# EAGLE schematic pressure_foot (EAGLE 6.2)
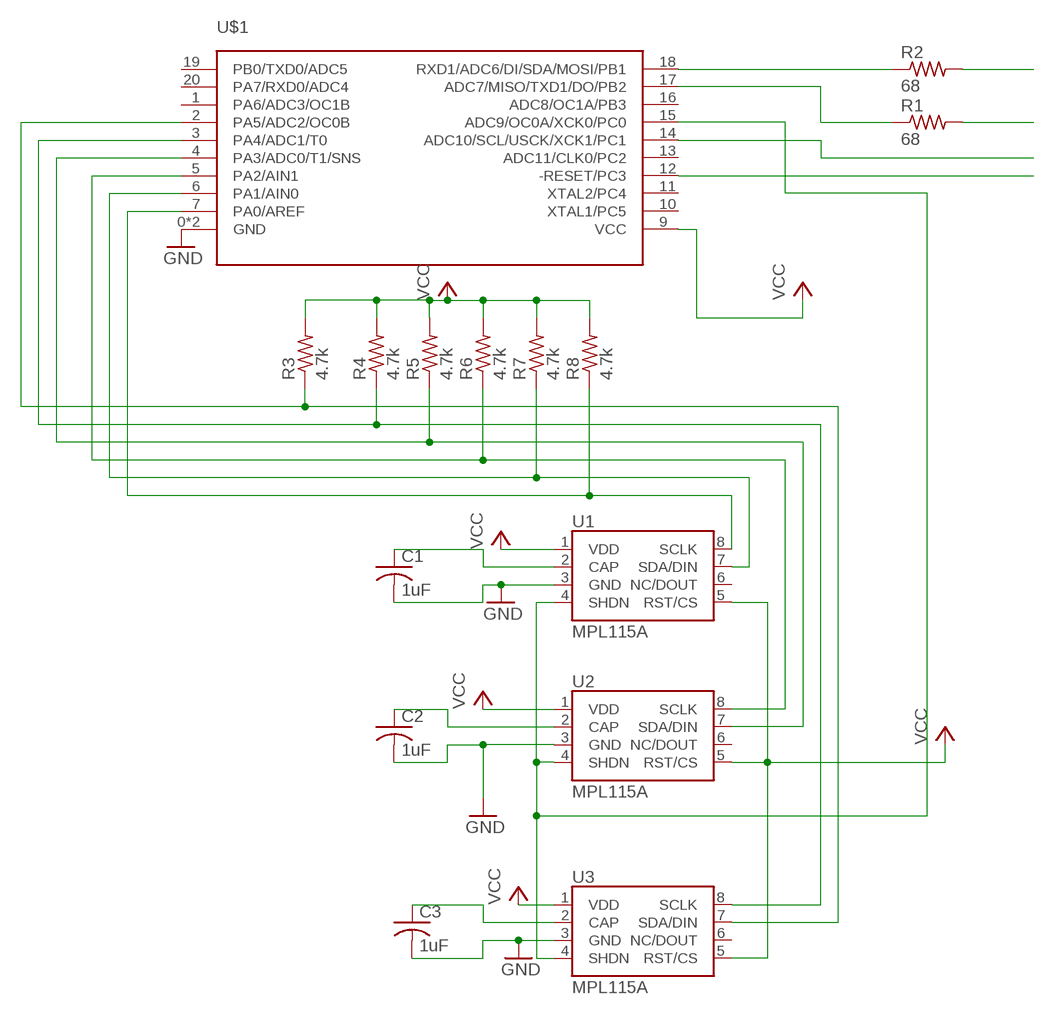
[diagram p0: schematic, sheet 1]

## Parts
C1  1uF  C-USC0603  [C0603]
C2  1uF  C-USC0603  [C0603]
C3  1uF  C-USC0603  [C0603]
R1  68  R-US_R0603  [R0603]
R2  68  R-US_R0603  [R0603]
R3  4.7k  R-US_R0603  [R0603]
R4  4.7k  R-US_R0603  [R0603]
R5  4.7k  R-US_R0603  [R0603]
R6  4.7k  R-US_R0603  [R0603]
R7  4.7k  R-US_R0603  [R0603]
R8  4.7k  R-US_R0603  [R0603]
U1  MPL115A  [LGA8]
U2  MPL115A  [LGA8]
U3  MPL115A  [LGA8]
U$1  ATTINY1634QFN20  [QFN20]

## Nets
GND: C1.2 C2.2 C3.2 U1.3(GND) U2.3(GND) U3.3(GND) U$1.0(GND) U$1.8(GND)
N$1: R8.1 U1.8(SCLK) U$1.7(PA0/AREF)
N$2: R1.2
N$3: R2.1 U$1.18(RXD1/ADC6/DI/SDA/MOSI/PB1)
N$4: R1.1 U$1.17(ADC7/MISO/TXD1/DO/PB2)
N$5: R2.2
N$6: C1.1 U1.2(CAP)
N$7: C3.1 U3.2(CAP)
N$8: R6.1 U2.8(SCLK) U$1.5(PA2/AIN1)
N$9: R5.1 U2.7(SDA/DIN) U$1.4(PA3/ADC0/T1/SNS)
N$10: U1.4(SHDN) U2.4(SHDN) U3.4(SHDN) U$1.15(ADC9/OC0A/XCK0/PC0)
N$11: C2.1 U2.2(CAP)
N$12: R7.1 U1.7(SDA/DIN) U$1.6(PA1/AIN0)
N$13: R4.1 U3.8(SCLK) U$1.3(PA4/ADC1/T0)
N$14: R3.1 U3.7(SDA/DIN) U$1.2(PA5/ADC2/OC0B)
N$15: U$1.14(ADC10/SCL/USCK/XCK1/PC1)
N$16: U$1.12(-RESET/PC3)
VCC: R3.2 R4.2 R5.2 R6.2 R7.2 R8.2 U1.1(VDD) U1.5(RST/CS) U2.1(VDD) U2.5(RST/CS) U3.1(VDD) U3.5(RST/CS) U$1.9(VCC)
Unconnected: U1.6(NC/DOUT) U2.6(NC/DOUT) U3.6(NC/DOUT) U$1.1(PA6/ADC3/OC1B) U$1.10(XTAL1/PC5) U$1.11(XTAL2/PC4) U$1.13(ADC11/CLK0/PC2) U$1.16(ADC8/OC1A/PB3) U$1.19(PB0/TXD0/ADC5) U$1.20(PA7/RXD0/ADC4)

## Library data of the parts
C1-C3 = rcl:C-US: CAPACITOR, American symbol
R1-R8 = rcl:R-US_: RESISTOR, American symbol
U1-U3 = SparkFun-Sensors:MPL115A: MPL115A1 (SPI) and MPL115A2 (I2C) Miniature Digital Barometer 5.0x3.0x1.2mm LGA Package
U$1 = attiny1634:ATTINY1634